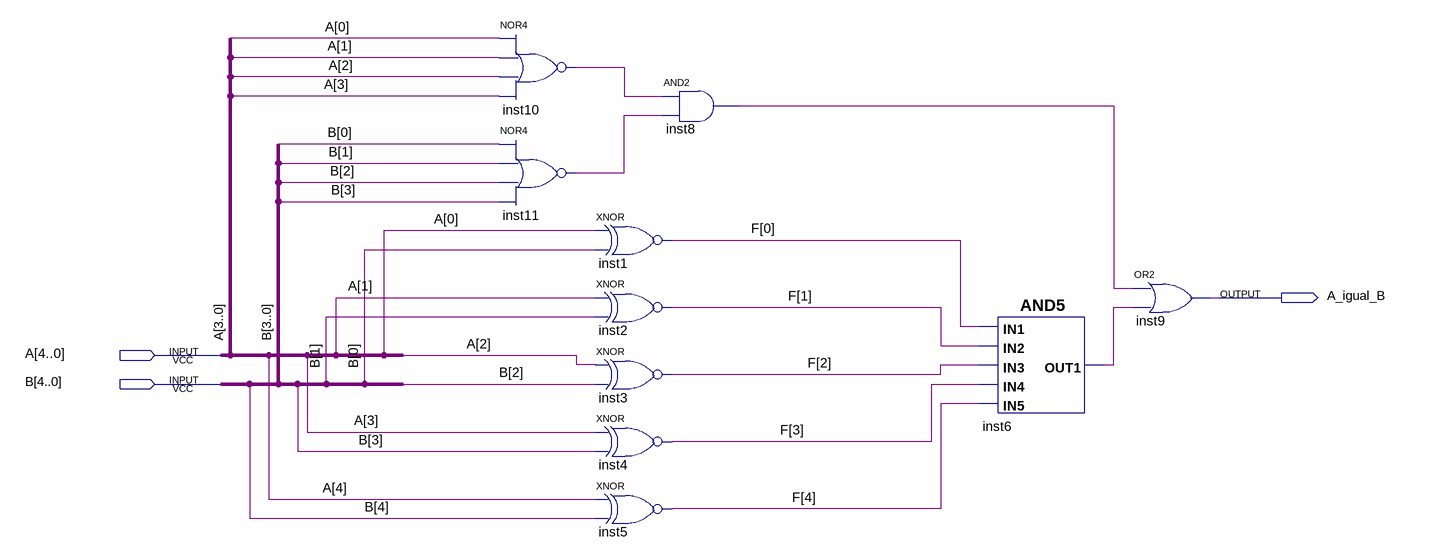
[diagram p0: schematic sheet]
// Quartus schematic Igual_5bits.bdf as structural Verilog: 10 symbols, 3 pins
module Igual_5bits (
  input  [4:0] A,
  input  [4:0] B,
  output A_igual_B
);

  wire inst6_out1, inst8_out, inst10_out, inst11_out;
  wire [4:0] F;

  nor inst10 (inst10_out, A[0], A[1], A[2], A[3]);
  nor inst11 (inst11_out, B[0], B[1], B[2], B[3]);
  xnor inst1 (F[0], A[0], B[0]);
  xnor inst2 (F[1], A[1], B[1]);
  xnor inst3 (F[2], A[2], B[2]);
  xnor inst4 (F[3], A[3], B[3]);
  xnor inst5 (F[4], A[4], B[4]);
  and inst8 (inst8_out, inst10_out, inst11_out);
  AND5 inst6 (.IN3(F[2]), .IN2(F[1]), .IN1(F[0]), .IN5(F[4]), .IN4(F[3]), .OUT1(inst6_out1));
  or inst9 (A_igual_B, inst8_out, inst6_out1);
endmodule
